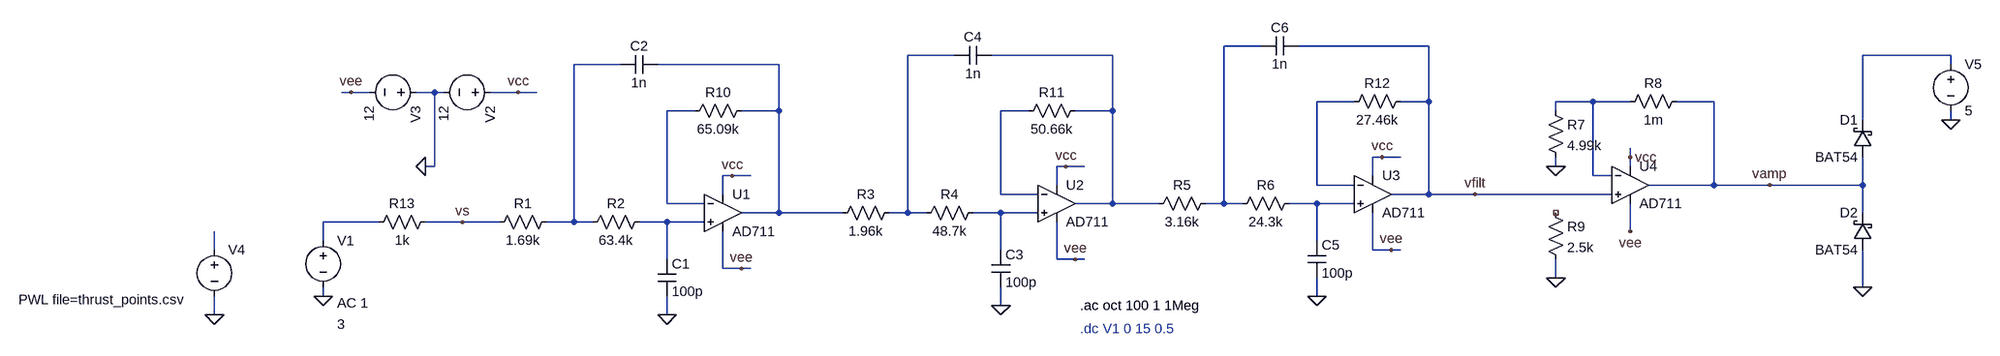
[diagram p0: schematic Anti-Aliasing Filter 30kHz 6th order Bessel_for_poster.asc]
Anti-Aliasing Filter 30kHz 6th order Bessel_for_poster.asc, the LTspice schematic file:
Version 4
SHEET 1 3004 744
WIRE 1472 -320 1408 -320
WIRE 1760 -320 1536 -320
WIRE 944 -304 864 -304
WIRE 1216 -304 1008 -304
WIRE 2912 -304 2752 -304
WIRE 368 -288 288 -288
WIRE 640 -288 432 -288
WIRE 2912 -288 2912 -304
WIRE -96 -240 -112 -240
WIRE -64 -240 -96 -240
WIRE 48 -240 16 -240
WIRE 64 -240 48 -240
WIRE 192 -240 144 -240
WIRE 224 -240 192 -240
WIRE 1632 -224 1568 -224
WIRE 1760 -224 1760 -320
WIRE 1760 -224 1712 -224
WIRE 2288 -224 2224 -224
WIRE 2352 -224 2288 -224
WIRE 2496 -224 2432 -224
WIRE 496 -208 448 -208
WIRE 640 -208 640 -288
WIRE 640 -208 576 -208
WIRE 1072 -208 1024 -208
WIRE 1216 -208 1216 -304
WIRE 1216 -208 1152 -208
WIRE 2224 -208 2224 -224
WIRE 2752 -192 2752 -304
WIRE 2912 -192 2912 -208
WIRE 1680 -128 1664 -128
WIRE 1712 -128 1680 -128
WIRE 2352 -128 2352 -144
WIRE 48 -112 48 -240
WIRE 48 -112 32 -112
WIRE 1136 -112 1120 -112
WIRE 1168 -112 1136 -112
WIRE 2224 -112 2224 -128
WIRE 2352 -112 2352 -128
WIRE 560 -96 544 -96
WIRE 592 -96 560 -96
WIRE 1664 -96 1664 -128
WIRE 2288 -96 2288 -224
WIRE 2320 -96 2288 -96
WIRE 1120 -80 1120 -112
WIRE 1568 -80 1568 -224
WIRE 1632 -80 1568 -80
WIRE 2496 -80 2496 -224
WIRE 2496 -80 2384 -80
WIRE 2592 -80 2496 -80
WIRE 2752 -80 2752 -128
WIRE 2752 -80 2592 -80
WIRE 544 -64 544 -96
WIRE 1024 -64 1024 -208
WIRE 1088 -64 1024 -64
WIRE 1760 -64 1760 -224
WIRE 1760 -64 1696 -64
WIRE 1840 -64 1760 -64
WIRE 2320 -64 1840 -64
WIRE 448 -48 448 -208
WIRE 512 -48 448 -48
WIRE 1216 -48 1216 -208
WIRE 1216 -48 1152 -48
WIRE 1296 -48 1216 -48
WIRE 1408 -48 1408 -320
WIRE 1408 -48 1376 -48
WIRE 1440 -48 1408 -48
WIRE 1568 -48 1520 -48
WIRE 1632 -48 1568 -48
WIRE 640 -32 640 -208
WIRE 640 -32 576 -32
WIRE 752 -32 640 -32
WIRE 864 -32 864 -304
WIRE 864 -32 832 -32
WIRE 896 -32 864 -32
WIRE 1024 -32 976 -32
WIRE 1088 -32 1024 -32
WIRE 2752 -32 2752 -80
WIRE -48 -16 -144 -16
WIRE 96 -16 32 -16
WIRE 160 -16 96 -16
WIRE 288 -16 288 -288
WIRE 288 -16 240 -16
WIRE 320 -16 288 -16
WIRE 448 -16 400 -16
WIRE 512 -16 448 -16
WIRE 2352 0 2352 -48
WIRE -144 16 -144 -16
WIRE 1568 16 1568 -48
WIRE -976 32 -976 0
WIRE 1024 32 1024 -32
WIRE 1664 32 1664 -32
WIRE 1696 32 1664 32
WIRE 1712 32 1696 32
WIRE 448 48 448 -16
WIRE 1120 48 1120 -16
WIRE 1152 48 1120 48
WIRE 1168 48 1152 48
WIRE 544 64 544 0
WIRE 576 64 544 64
WIRE 592 64 576 64
WIRE 2224 80 2224 48
WIRE 2752 96 2752 32
WIRE -144 112 -144 96
WIRE 1568 112 1568 80
WIRE 1024 128 1024 96
WIRE -976 144 -976 112
WIRE 448 144 448 112
FLAG -144 112 0
FLAG 448 144 0
FLAG 32 -112 0
FLAG 192 -240 vcc
FLAG -96 -240 vee
FLAG 1024 128 0
FLAG 1568 112 0
FLAG 1840 -64 vfilt
FLAG 2352 -128 vcc
FLAG 2352 0 vee
FLAG 2224 -112 0
FLAG 2592 -80 vamp
FLAG 2224 80 0
FLAG -976 144 0
FLAG 2752 96 0
FLAG 2912 -192 0
FLAG 96 -16 vs
FLAG 560 -96 vcc
FLAG 576 64 vee
FLAG 1136 -112 vcc
FLAG 1152 48 vee
FLAG 1680 -128 vcc
FLAG 1696 32 vee
SYMBOL voltage -144 0 R0
WINDOW 123 24 124 Left 2
WINDOW 39 0 0 Left 0
WINDOW 3 24 160 Left 2
SYMATTR Value2 AC 1
SYMATTR Value 3
SYMATTR InstName V1
SYMBOL res 256 -32 R90
WINDOW 0 0 56 VBottom 2
WINDOW 3 32 56 VTop 2
SYMATTR InstName R1
SYMATTR Value 1.69k
SYMBOL res 416 -32 R90
WINDOW 0 0 56 VBottom 2
WINDOW 3 32 56 VTop 2
SYMATTR InstName R2
SYMATTR Value 63.4k
SYMBOL cap 432 48 R0
SYMATTR InstName C1
SYMATTR Value 100p
SYMBOL cap 432 -304 R90
WINDOW 0 0 32 VBottom 2
WINDOW 3 32 32 VTop 2
SYMATTR InstName C2
SYMATTR Value 1n
SYMBOL OpAmps\\AD711 544 -96 R0
SYMATTR InstName U1
SYMBOL voltage 160 -240 R90
WINDOW 123 0 0 Left 0
WINDOW 39 0 0 Left 0
SYMATTR InstName V2
SYMATTR Value 12
SYMBOL voltage 32 -240 R90
WINDOW 123 0 0 Left 0
WINDOW 39 0 0 Left 0
SYMATTR InstName V3
SYMATTR Value 12
SYMBOL res 848 -48 R90
WINDOW 0 0 56 VBottom 2
WINDOW 3 32 56 VTop 2
SYMATTR InstName R3
SYMATTR Value 1.96k
SYMBOL res 992 -48 R90
WINDOW 0 0 56 VBottom 2
WINDOW 3 32 56 VTop 2
SYMATTR InstName R4
SYMATTR Value 48.7k
SYMBOL cap 1008 32 R0
SYMATTR InstName C3
SYMATTR Value 100p
SYMBOL cap 1008 -320 R90
WINDOW 0 0 32 VBottom 2
WINDOW 3 32 32 VTop 2
SYMATTR InstName C4
SYMATTR Value 1n
SYMBOL res 1392 -64 R90
WINDOW 0 0 56 VBottom 2
WINDOW 3 32 56 VTop 2
SYMATTR InstName R5
SYMATTR Value 3.16k
SYMBOL res 1536 -64 R90
WINDOW 0 0 56 VBottom 2
WINDOW 3 32 56 VTop 2
SYMATTR InstName R6
SYMATTR Value 24.3k
SYMBOL cap 1552 16 R0
SYMATTR InstName C5
SYMATTR Value 100p
SYMBOL cap 1536 -336 R90
WINDOW 0 0 32 VBottom 2
WINDOW 3 32 32 VTop 2
SYMATTR InstName C6
SYMATTR Value 1n
SYMBOL OpAmps\\AD711 2352 -144 R0
SYMATTR InstName U4
SYMBOL res 2208 -224 R0
SYMATTR InstName R7
SYMATTR Value 4.99k
SYMBOL res 2448 -240 R90
WINDOW 0 0 56 VBottom 2
WINDOW 3 32 56 VTop 2
SYMATTR InstName R8
SYMATTR Value 1m
SYMBOL res 2208 -48 R0
SYMATTR InstName R9
SYMATTR Value 2.5k
SYMBOL voltage -976 16 R0
WINDOW 123 0 0 Left 0
WINDOW 39 0 0 Left 0
WINDOW 3 -337 102 Left 2
SYMATTR Value PWL file=thrust_points.csv
SYMATTR InstName V4
SYMBOL res 1168 -224 R90
WINDOW 0 0 56 VBottom 2
WINDOW 3 32 56 VTop 2
SYMATTR InstName R11
SYMATTR Value 50.66k
SYMBOL res 1728 -240 R90
WINDOW 0 0 56 VBottom 2
WINDOW 3 32 56 VTop 2
SYMATTR InstName R12
SYMATTR Value 27.46k
SYMBOL res 592 -224 R90
WINDOW 0 0 56 VBottom 2
WINDOW 3 32 56 VTop 2
SYMATTR InstName R10
SYMATTR Value 65.09k
SYMBOL schottky 2768 -128 R180
WINDOW 0 24 64 Left 2
WINDOW 3 24 0 Left 2
SYMATTR InstName D1
SYMATTR Value BAT54
SYMATTR Description Diode
SYMATTR Type diode
SYMBOL schottky 2768 32 R180
WINDOW 0 24 64 Left 2
WINDOW 3 24 0 Left 2
SYMATTR InstName D2
SYMATTR Value BAT54
SYMATTR Description Diode
SYMATTR Type diode
SYMBOL voltage 2912 -304 R0
WINDOW 123 0 0 Left 0
WINDOW 39 0 0 Left 0
SYMATTR InstName V5
SYMATTR Value 5
SYMBOL res 48 -32 R90
WINDOW 0 0 56 VBottom 2
WINDOW 3 32 56 VTop 2
SYMATTR InstName R13
SYMATTR Value 1k
SYMBOL OpAmps\\AD711 1120 -112 R0
SYMATTR InstName U2
SYMBOL OpAmps\\AD711 1664 -128 R0
SYMATTR InstName U3
TEXT 1160 128 Left 2 !.ac oct 100 1 1Meg
TEXT 1160 168 Left 2 ;.dc V1 0 15 0.5

The netlist it stands for:
* Anti-Aliasing Filter 30kHz 6th order Bessel_for_poster.asc
V1 N013 0 3 AC 1
R1 N005 vs 1.69k
R2 N014 N005 63.4k
C1 N014 0 100p
C2 N006 N005 1n
XU1 N014 N009 vcc vee N006 AD712  ; AD711, pins In+ In- V+ V- OUT
V2 vcc 0 12
V3 0 vee 12
R3 N002 N006 1.96k
R4 N012 N002 48.7k
C3 N012 0 100p
C4 N003 N002 1n
R5 N001 N003 3.16k
R6 N011 N001 24.3k
C5 N011 0 100p
C6 vfilt N001 1n
XU4 vfilt N008 vcc vee vamp AD712  ; AD711, pins In+ In- V+ V- OUT
R7 N008 0 4.99k
R8 vamp N008 1m
R9 NC_01 0 2.5k
V4 N015 0 PWL file=thrust_points.csv
R11 N003 N010 50.66k
R12 vfilt N007 27.46k
R10 N006 N009 65.09k
D1 vamp N004 BAT54
D2 0 vamp BAT54
V5 N004 0 5
R13 vs N013 1k
XU2 N012 N010 vcc vee N003 AD712  ; AD711, pins In+ In- V+ V- OUT
XU3 N011 N007 vcc vee vfilt AD712  ; AD711, pins In+ In- V+ V- OUT
.model D D
.lib standard.dio
.ac oct 100 1 1Meg
* .dc V1 0 15 0.5
.lib ADI1.lib
.backanno
.end